# Altium schematic sheet ChargerModule.SchDoc
size A
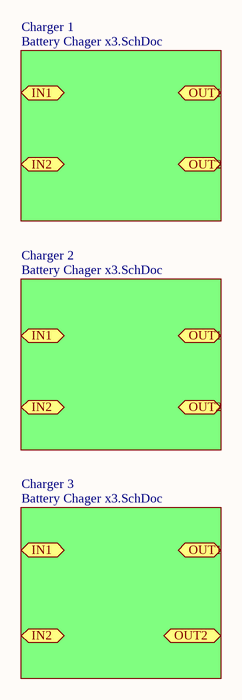
[diagram p0: ChargerModule.SchDoc]

## Sub-sheets
Charger 1 = Battery Chager x3.SchDoc: no entries
Charger 2 = Battery Chager x3.SchDoc: no entries
Charger 3 = Battery Chager x3.SchDoc: no entries

## Ports
IN1, IN2, OUT1, OUT2